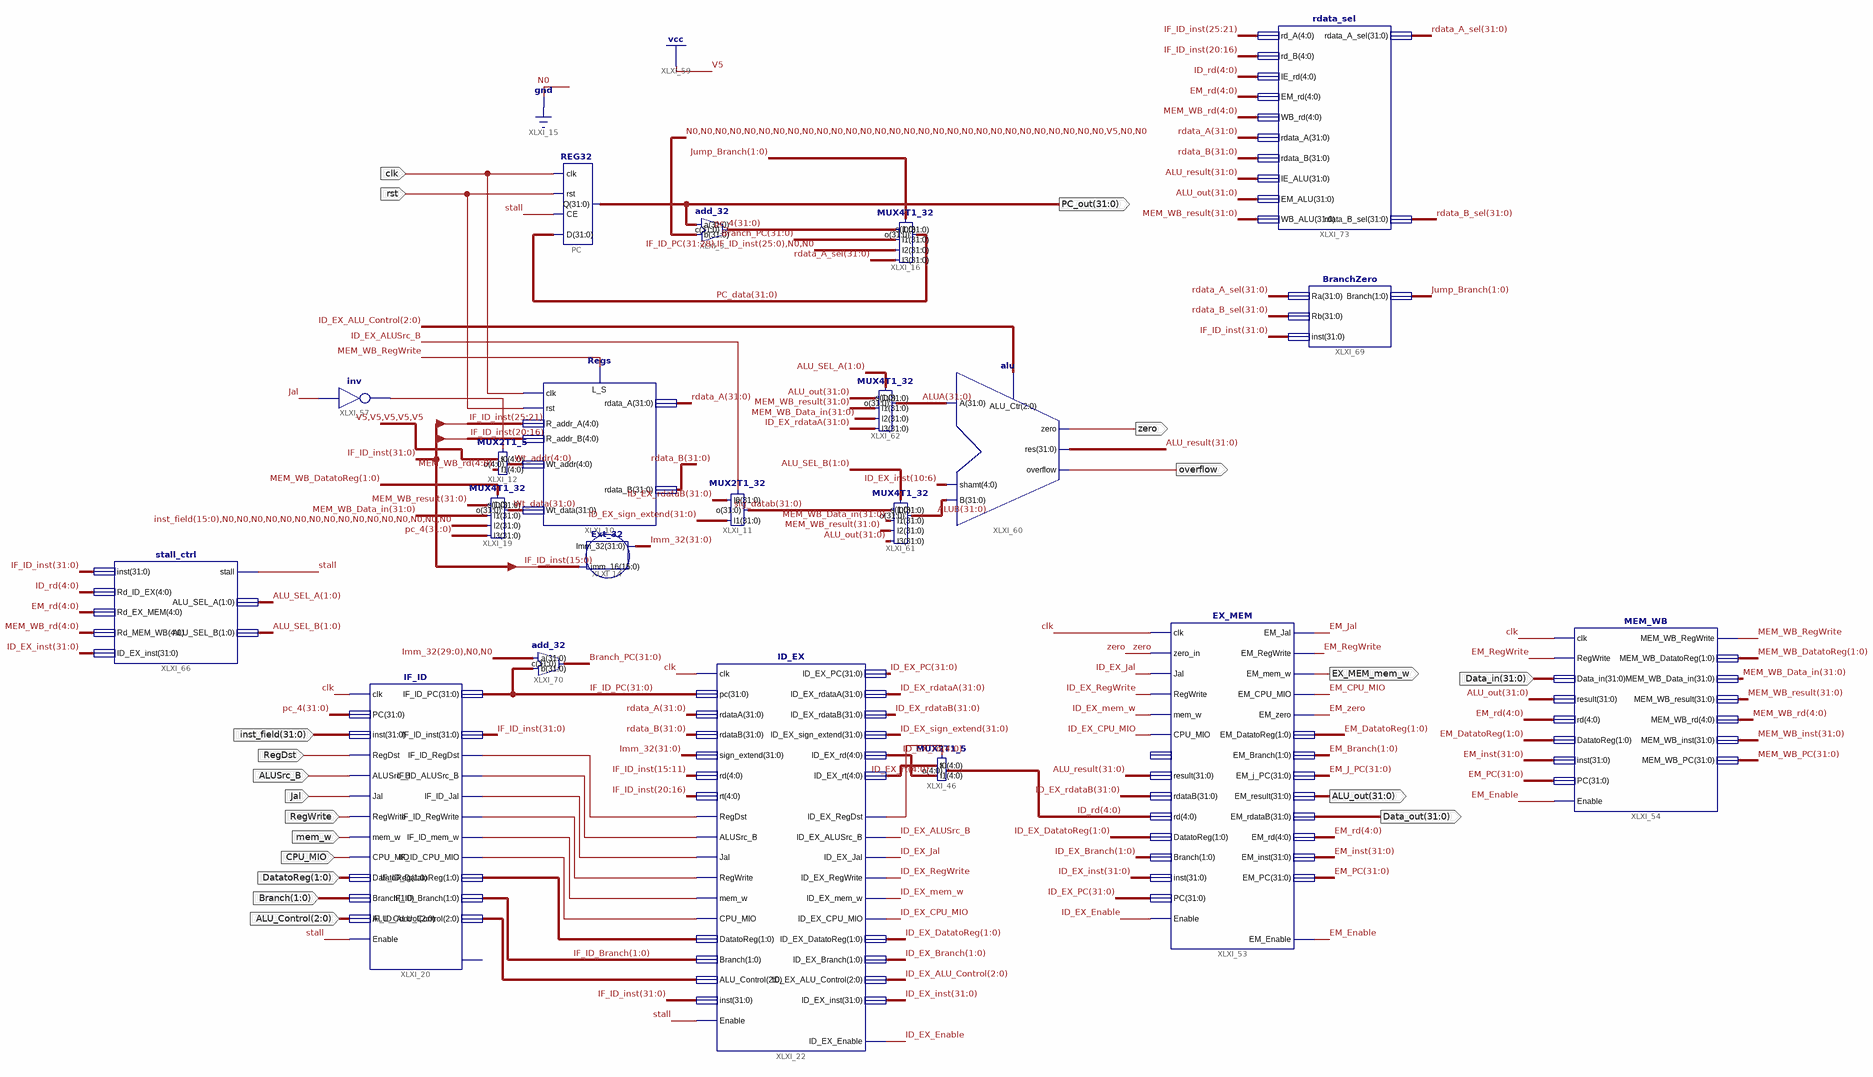
[diagram p0: schematic sheet 1]
// Xilinx ISE schematic Data_path.sch (kintex7) as structural Verilog: 21 symbols, 19 ports
module Data_path (
  input  clk,
  input  rst,
  input  Jal,
  input  [31:0] inst_field,
  input  RegDst,
  input  [31:0] Data_in,
  input  ALUSrc_B,
  input  RegWrite,
  input  mem_w,
  input  CPU_MIO,
  input  [1:0] DatatoReg,
  input  [2:0] ALU_Control,
  input  [1:0] Branch,
  output [31:0] PC_out,
  output zero,
  output overflow,
  output [31:0] Data_out,
  output [31:0] ALU_out,
  output EX_MEM_mem_w
);

  wire EM_CPU_MIO, EM_Enable, EM_Jal, EM_RegWrite, EM_zero, ID_EX_ALUSrc_B, ID_EX_CPU_MIO, ID_EX_Enable,
       ID_EX_Jal, ID_EX_mem_w, ID_EX_RegWrite, MEM_WB_RegWrite, stall, XLXN_127, XLXN_225, XLXN_229,
       XLXN_230, XLXN_232, XLXN_234, XLXN_236, XLXN_238;
  wire [1:0] ALU_SEL_A, ALU_SEL_B, EM_Branch, EM_DatatoReg, ID_EX_Branch, ID_EX_DatatoReg, IF_ID_Branch,
       Jump_Branch, MEM_WB_DatatoReg, XLXN_240;
  wire [2:0] ID_EX_ALU_Control, XLXN_244;
  wire [4:0] EM_rd, ID_EX_rd, ID_EX_rt, ID_rd, MEM_WB_rd, Wt_addr;
  wire [31:0] ALU_result, ALUA, ALUB, Branch_PC, EM_inst, EM_J_PC, EM_PC, ID_EX_inst, ID_EX_PC, ID_EX_rdataA,
       ID_EX_rdataB, ID_EX_sign_extend, IF_ID_inst, IF_ID_PC, Imm_32, MEM_WB_Data_in, MEM_WB_inst, MEM_WB_PC,
       MEM_WB_result, pc_4, PC_data, rdata_A, rdata_A_sel, rdata_B, rdata_B_sel, sig_datab, Wt_data;

  REG32 PC (.D(PC_data), .CE(stall), .rst(rst), .clk(clk), .Q(PC_out));
  add_32 XLXI_3 (.b(32'b00000000000000000000000000000100), .a(PC_out), .c(pc_4));
  Regs #(.VeriModel("regs")) XLXI_10 (
    .clk(clk), .L_S(MEM_WB_RegWrite), .rdata_A(rdata_A), .rst(rst), .Wt_data(Wt_data), .rdata_B(rdata_B),
    .R_addr_A(IF_ID_inst[25:21]), .R_addr_B(IF_ID_inst[20:16]), .Wt_addr(Wt_addr));
  MUX2T1_32 XLXI_11 (.s(ID_EX_ALUSrc_B), .I0(ID_EX_rdataB), .I1(ID_EX_sign_extend), .o(sig_datab));
  MUX2T1_5 XLXI_12 (.I1(MEM_WB_rd), .I0({5{1'b1}}), .o(Wt_addr), .s(XLXN_225));
  Ext_32 XLXI_14 (.imm_16(IF_ID_inst[15:0]), .Imm_32(Imm_32));
  MUX4T1_32 XLXI_16 (
    .s(Jump_Branch), .I0(pc_4), .I1(Branch_PC), .I2({IF_ID_PC[31:28], IF_ID_inst[25:0], 2'b00}),
    .I3(rdata_A_sel), .o(PC_data));
  MUX4T1_32 XLXI_19 (
    .s(MEM_WB_DatatoReg), .I0(MEM_WB_result), .I1(MEM_WB_Data_in), .I2({inst_field[15:0], {16{1'b0}}}),
    .I3(pc_4), .o(Wt_data));
  ID_EX XLXI_22 (
    .clk(clk), .RegDst(XLXN_229), .ALUSrc_B(XLXN_230), .Jal(XLXN_232), .RegWrite(XLXN_234), .mem_w(XLXN_236),
    .CPU_MIO(XLXN_238), .Enable(stall), .pc(IF_ID_PC), .rdataA(rdata_A), .rdataB(rdata_B),
    .sign_extend(Imm_32), .rd(IF_ID_inst[15:11]), .rt(IF_ID_inst[20:16]), .inst(IF_ID_inst),
    .DatatoReg(XLXN_240), .Branch(IF_ID_Branch), .ALU_Control(XLXN_244), .ID_EX_RegDst(XLXN_127),
    .ID_EX_ALUSrc_B(ID_EX_ALUSrc_B), .ID_EX_Jal(ID_EX_Jal), .ID_EX_RegWrite(ID_EX_RegWrite),
    .ID_EX_mem_w(ID_EX_mem_w), .ID_EX_CPU_MIO(ID_EX_CPU_MIO), .ID_EX_DatatoReg(ID_EX_DatatoReg),
    .ID_EX_Branch(ID_EX_Branch), .ID_EX_ALU_Control(ID_EX_ALU_Control), .ID_EX_PC(ID_EX_PC),
    .ID_EX_rdataA(ID_EX_rdataA), .ID_EX_rdataB(ID_EX_rdataB), .ID_EX_sign_extend(ID_EX_sign_extend),
    .ID_EX_rd(ID_EX_rd), .ID_EX_rt(ID_EX_rt), .ID_EX_inst(ID_EX_inst), .ID_EX_Enable(ID_EX_Enable));
  MUX2T1_5 XLXI_46 (.I1(ID_EX_rd), .I0(ID_EX_rt), .o(ID_rd), .s(XLXN_127));
  IF_ID XLXI_20 (
    .clk(clk), .RegDst(RegDst), .ALUSrc_B(ALUSrc_B), .Jal(Jal), .RegWrite(RegWrite), .mem_w(mem_w),
    .CPU_MIO(CPU_MIO), .Enable(stall), .PC(pc_4), .inst(inst_field), .DatatoReg(DatatoReg), .Branch(Branch),
    .ALU_Control(ALU_Control), .IF_ID_RegDst(XLXN_229), .IF_ID_ALUSrc_B(XLXN_230), .IF_ID_Jal(XLXN_232),
    .IF_ID_RegWrite(XLXN_234), .IF_ID_mem_w(XLXN_236), .IF_ID_CPU_MIO(XLXN_238), .IF_ID_PC(IF_ID_PC),
    .IF_ID_inst(IF_ID_inst), .IF_ID_DatatoReg(XLXN_240), .IF_ID_Branch(IF_ID_Branch),
    .IF_ID_ALU_Control(XLXN_244));  // open: IF_ID_Enable
  EX_MEM XLXI_53 (
    .clk(clk), .zero_in(zero), .Jal(ID_EX_Jal), .RegWrite(ID_EX_RegWrite), .mem_w(ID_EX_mem_w),
    .CPU_MIO(ID_EX_CPU_MIO), .Enable(ID_EX_Enable), .result(ALU_result), .rdataB(ID_EX_rdataB), .rd(ID_rd),
    .DatatoReg(ID_EX_DatatoReg), .Branch(ID_EX_Branch), .inst(ID_EX_inst), .PC(ID_EX_PC), .EM_Jal(EM_Jal),
    .EM_RegWrite(EM_RegWrite), .EM_mem_w(EX_MEM_mem_w), .EM_CPU_MIO(EM_CPU_MIO), .EM_zero(EM_zero),
    .EM_DatatoReg(EM_DatatoReg), .EM_Branch(EM_Branch), .EM_j_PC(EM_J_PC), .EM_result(ALU_out),
    .EM_rdataB(Data_out), .EM_rd(EM_rd), .EM_inst(EM_inst), .EM_PC(EM_PC), .EM_Enable(EM_Enable));  // open: j_PC
  MEM_WB XLXI_54 (
    .clk(clk), .RegWrite(EM_RegWrite), .Enable(EM_Enable), .Data_in(Data_in), .result(ALU_out), .rd(EM_rd),
    .DatatoReg(EM_DatatoReg), .inst(EM_inst), .PC(EM_PC), .MEM_WB_RegWrite(MEM_WB_RegWrite),
    .MEM_WB_DatatoReg(MEM_WB_DatatoReg), .MEM_WB_Data_in(MEM_WB_Data_in), .MEM_WB_result(MEM_WB_result),
    .MEM_WB_rd(MEM_WB_rd), .MEM_WB_inst(MEM_WB_inst), .MEM_WB_PC(MEM_WB_PC));
  not XLXI_57 (XLXN_225, Jal);
  alu XLXI_60 (
    .ALU_Ctr(ID_EX_ALU_Control), .res(ALU_result), .zero(zero), .overflow(overflow), .A(ALUA), .B(ALUB),
    .shamt(ID_EX_inst[10:6]));
  MUX4T1_32 XLXI_61 (.s(ALU_SEL_B), .I0(sig_datab), .I1(MEM_WB_Data_in), .I2(MEM_WB_result), .I3(ALU_out), .o(ALUB));
  MUX4T1_32 XLXI_62 (.s(ALU_SEL_A), .I0(ALU_out), .I1(MEM_WB_result), .I2(MEM_WB_Data_in), .I3(ID_EX_rdataA), .o(ALUA));
  stall_ctrl XLXI_66 (
    .inst(IF_ID_inst), .Rd_ID_EX(ID_rd), .Rd_EX_MEM(EM_rd), .Rd_MEM_WB(MEM_WB_rd), .stall(stall),
    .ALU_SEL_A(ALU_SEL_A), .ALU_SEL_B(ALU_SEL_B), .ID_EX_inst(ID_EX_inst));
  add_32 XLXI_70 (.b(IF_ID_PC), .a({Imm_32[29:0], 2'b00}), .c(Branch_PC));
  BranchZero XLXI_69 (.Ra(rdata_A_sel), .Rb(rdata_B_sel), .inst(IF_ID_inst), .Branch(Jump_Branch));
  rdata_sel XLXI_73 (
    .rd_A(IF_ID_inst[25:21]), .rd_B(IF_ID_inst[20:16]), .IE_rd(ID_rd), .EM_rd(EM_rd), .WB_rd(MEM_WB_rd),
    .rdata_A(rdata_A), .rdata_B(rdata_B), .IE_ALU(ALU_result), .EM_ALU(ALU_out), .WB_ALU(MEM_WB_result),
    .rdata_A_sel(rdata_A_sel), .rdata_B_sel(rdata_B_sel));
endmodule
